# EasyEDA Pro project ProProject_Project_RK818_TestBoard.epro

# Board PCB1
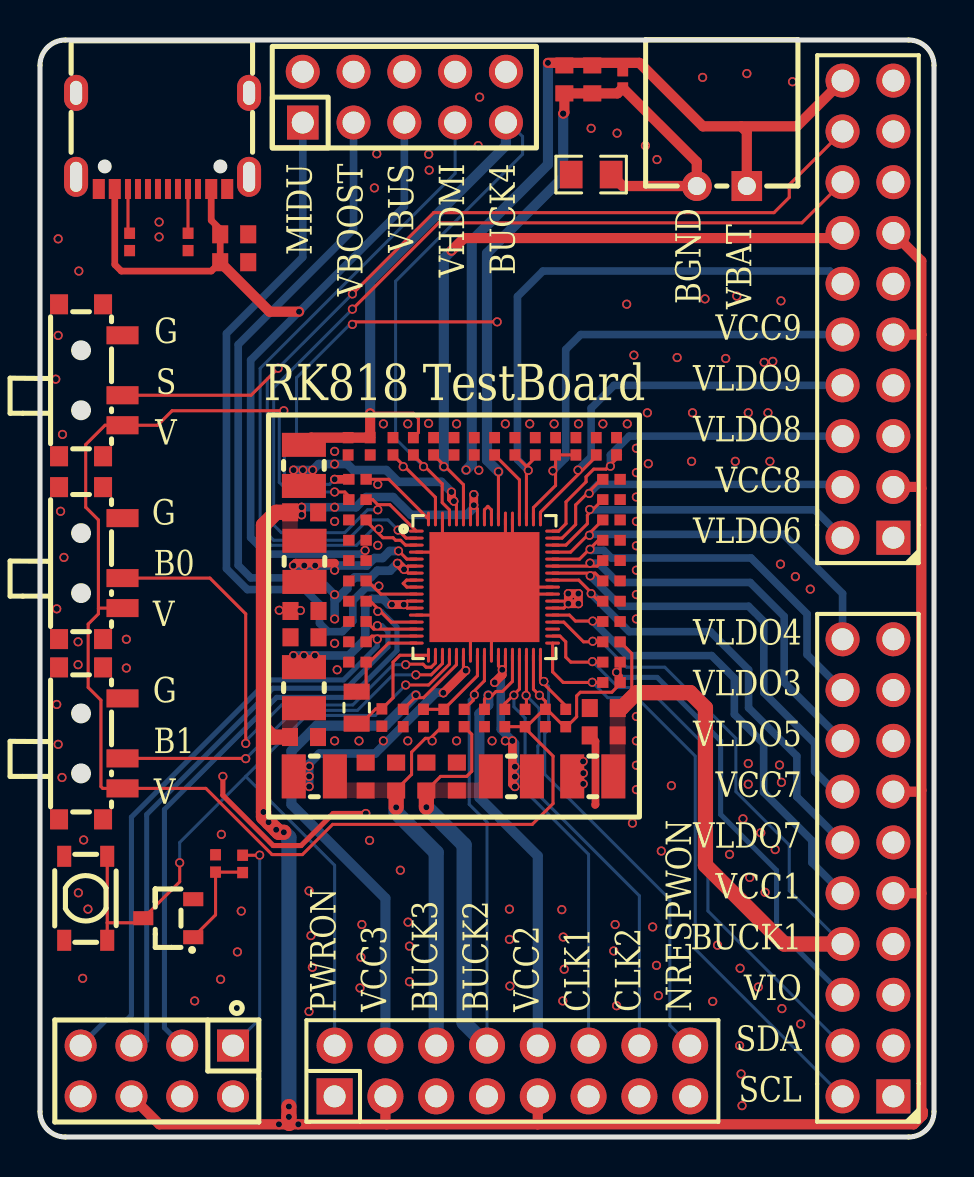
[diagram p0: board, top side]
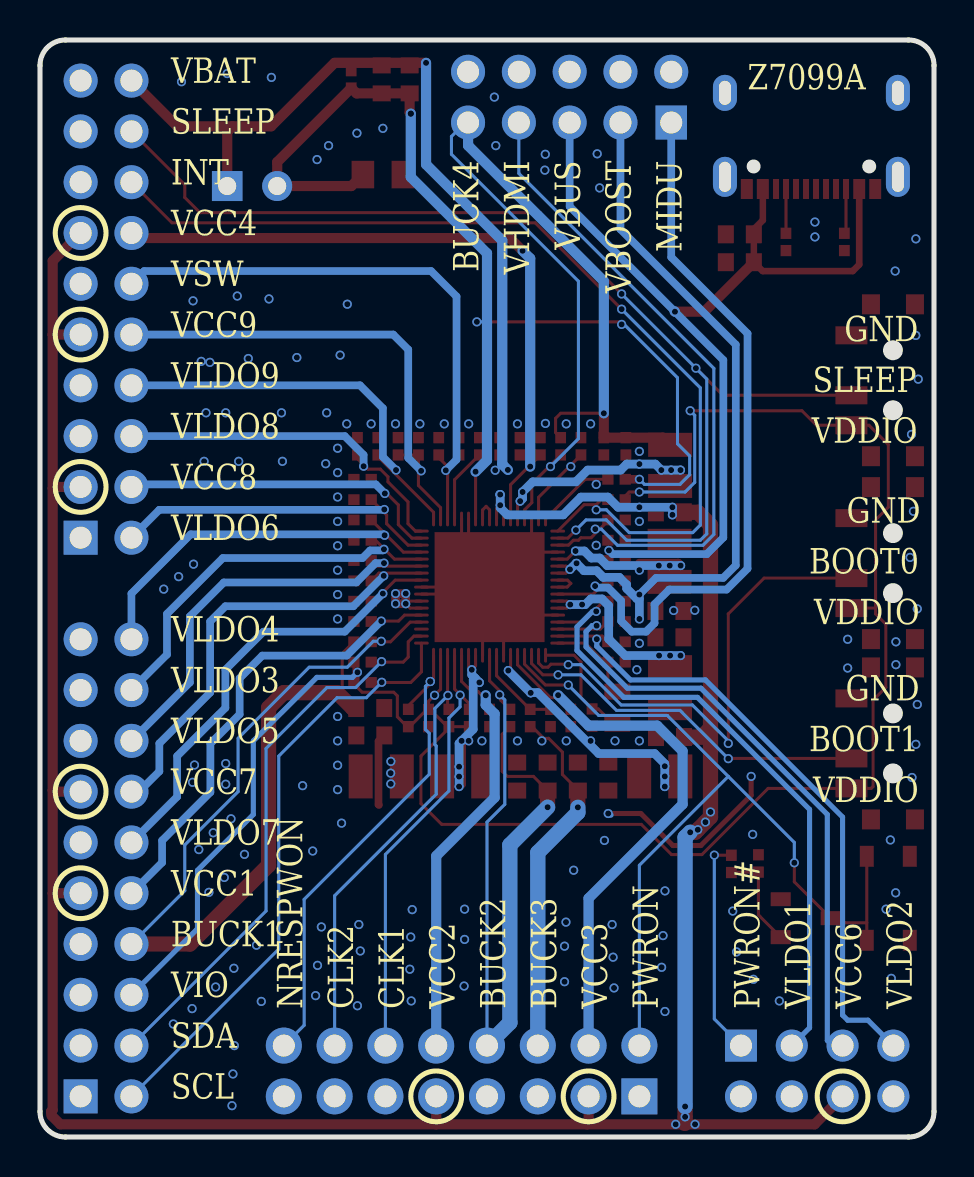
[diagram p1: board, bottom side, seen from below]

Outline 44.7 x 54.86 mm; copper layers: Top Layer, Bottom Layer. Coordinates in mm from the lower left corner of the outline.
Outline path: 0,53.59 0,1.27 arc(0.37,0.37) 1.27,0 43.43,0 arc(44.33,0.37) 44.7,1.27 44.7,53.59 arc(44.33,54.49) 43.43,54.86 1.27,54.86 arc(0.37,54.49) 0,53.59
Stack: Top Layer 0.035mm / Dielectric1 1.51mm FR4 er 4.5 / Bottom Layer 0.035mm

## Design rules (mm)
template: 用户自定义配置
spacing copperThickness1oz (default): track to track 0.102, other pairs 0.102 to 0.3
spacing copperThicknessInner0.5oz: track to track 0.089, other pairs 0.076 to 0.3
track width copperThickness1oz: min 0.076, default 0.152, max 2.54
track width copperThickness0.5oz: min 0.076, default 0.254, max 2.54
track width 50ohm-E (default): min 0.076, default 0.117, max 2.54
track width 50ohm-I: min 0.076, default 0.119, max 2.54
track width 40ohm-E: min 0.076, default 0.178, max 2.54
track width 40ohm-I: min 0.076, default 0.188, max 2.54
differential pair 90ohm-E: width min 0.076, default 0.102, max 2.54; gap min 0.102, default 0.102
differential pair 90ohm-I: width min 0.076, default 0.094, max 2.54; gap min 0.102, default 0.109
differential pair 100ohm-E (default): width min 0.076, default 0.094, max 2.54; gap min 0.152, default 0.16
differential pair 100ohm-I: width min 0.076, default 0.089, max 2.54; gap min 0.152, default 0.165
differential pair 80ohm-E: width min 0.076, default 0.137, max 2.54; gap min 0.102, default 0.117
differential pair 80ohm-I: width min 0.076, default 0.132, max 2.54; gap min 0.102, default 0.122
via viaSize (default): diameter min 0.457, default 0.457, max 10; hole min 0.279, default 0.3, max 6.299
net GND uses 内部电源
net $1N2385 uses 内部电源
net VSYS uses 内部电源
net $1N2423 uses 内部电源
net VBOOST uses 内部电源
net $1N3387 uses 内部电源
net $1N3668 uses 内部电源
net $1N3814 uses 内部电源
net $1N3998 uses 内部电源
pour e396 uses 内部电源
pour e426 uses 内部电源

## Placement (name value [footprint] x y rotation side)
C1  12.5pF  [C0402-无丝印-全尺寸]  15.88 23.75 180 top
C2  12.5pF  [C0402-无丝印-全尺寸]  17.09 20.98 270 top
C3  100nF  [C0402-无丝印-全尺寸]  22.73 34.54 90 top
C4  10uF  [C0402-无丝印-全尺寸]  25.27 20.95 90 top
C5  10uF  [C0402-无丝印-全尺寸]  15.88 29.84 0 top
C6  10uF  [C0402-无丝印-全尺寸]  15.88 28.83 0 top
C7  10uF  [C0402-无丝印-全尺寸]  15.88 30.86 0 top
C8  10uF  [C0402-无丝印-全尺寸]  15.88 27.81 0 top
C9  10uF  [C0402-无丝印-全尺寸]  21.72 34.54 270 top
C10  10uF  [C0402-无丝印-全尺寸]  20.7 34.54 270 top
C11  22uF  [C0603-无丝印-全尺寸]  13.21 31.24 180 top
C12  22uF  [C0603-无丝印-全尺寸]  13.2 20 180 top
C13  22uF  [C0603-无丝印-全尺寸]  13.23 24.99 0 top
C14  22uF  [C0603-无丝印-全尺寸]  13.23 26.31 0 top
C15  10uF  [C0402-无丝印-全尺寸]  28.58 25.78 180 top
C16  10uF  [C0402-无丝印-全尺寸]  22.22 20.95 90 top
C17  10uF  [C0402-无丝印-全尺寸]  18.16 20.95 90 top
C18  10uF  [C0402-无丝印-全尺寸]  19.69 34.54 270 top
C19  10uF  [C0402-无丝印-全尺寸]  15.88 25.78 0 top
C20  10uF  [C0402-无丝印-全尺寸]  28.58 27.81 180 top
C21  10uF  [C0402-无丝印-全尺寸]  28.58 32.89 180 top
C22  10uF  [C0402-无丝印-全尺寸]  26.8 34.54 270 top
C23  22uF  [C0603-无丝印-全尺寸]  28.19 21.45 0 top
C24  22uF  [C0603-无丝印-全尺寸]  28.19 20.08 0 top
C25  22uF  [C0603-无丝印-全尺寸]  19.32 18.03 270 top
C26  22uF  [C0603-无丝印-全尺寸]  20.84 18.03 270 top
C27  22uF  [C0603-无丝印-全尺寸]  16.28 18.03 270 top
C28  22uF  [C0603-无丝印-全尺寸]  17.81 18.03 270 top
C31  10uF  [C0402-无丝印-全尺寸]  15.88 26.8 0 top
C32  10uF  [C0402-无丝印-全尺寸]  15.88 24.76 0 top
C33  10uF  [C0402-无丝印-全尺寸]  28.58 29.84 180 top
C34  10uF  [C0402-无丝印-全尺寸]  28.58 28.83 180 top
C35  10uF  [C0402-无丝印-全尺寸]  28.58 26.8 180 top
C36  10uF  [C0402-无丝印-全尺寸]  28.58 30.86 180 top
C37  10uF  [C0402-无丝印-全尺寸]  28.58 31.88 180 top
C38  10uF  [C0402-无丝印-全尺寸]  28.83 34.54 270 top
C39  10uF  [C0402-无丝印-全尺寸]  27.81 34.54 270 top
C40  10uF  [C0402-无丝印-全尺寸]  23.75 34.54 270 top
C41  100nF  [C0402-无丝印-全尺寸]  29.14 52.89 270 top
C42  22uF  [C0603-无丝印-全尺寸]  27.62 52.89 90 top
C43  22uF  [C0603-无丝印-全尺寸]  26.22 52.89 90 top
C44  22uF  [C0603-无丝印-全尺寸]  9.71 43.75 180 top
C45  22uF  [C0603-无丝印-全尺寸]  9.71 45.15 180 top
C46  10uF  [C0402-无丝印-全尺寸]  15.41 34.54 90 top
C47  10uF  [C0402-无丝印-全尺寸]  16.51 34.54 90 top
C48  10uF  [C0402-无丝印-全尺寸]  24.77 34.54 270 top
C49  10uF  [C0402-无丝印-全尺寸]  25.78 34.54 270 top
CN1  ZX-XH2.54-2PWZ  [CONN-TH_2P-P2.50_ZX-XH2.54-2PWZ]  34.09 47.56 180 top
H1  -  [HDR-TH_10P-P2.54-V-F-R2-C5-S2.54]  18.22 52 0 top
H2  -  [HDR-TH_16P-P2.54-V-F-R2-C8-S2.54-1]  23.62 3.3 0 top
H3  -  [HDR-TH_20P-P2.54-V-R2-C10-S2.54]  41.4 41.4 90 top
H4  -  [HDR-TH_8P-P2.54-V-F-R2-C4-S2.54-1]  5.84 3.3 180 top
H5  -  [HDR-TH_20P-P2.54-V-R2-C10-S2.54]  41.4 13.46 90 top
R1  100K  [R0402-无丝印-全尺寸]  15.88 31.88 180 top
R2  100K  [R0402-无丝印-全尺寸]  23.24 20.95 270 top
R3  100K  [R0402-无丝印-全尺寸]  24.26 20.95 270 top
R4  4.7K  [R0402-无丝印-全尺寸]  28.58 22.73 0 top
R5  100K  [R0402-无丝印-全尺寸]  26.29 20.95 270 top
R6  4.7K  [R0402-无丝印-全尺寸]  28.58 23.75 0 top
R7  4.7K  [R0402-无丝印-全尺寸]  8.78 13.68 90 top
R8  22R  [R0402-无丝印-全尺寸]  10.13 13.66 270 top
R9  NC  [R0402-无丝印-全尺寸]  17.65 34.54 270 top
R10  10mΩ  [R0805]  27.56 48.13 0 top
R11  NC  [R0402-无丝印-全尺寸]  15.88 32.89 0 top
R12  100R  [R0402-无丝印-全尺寸]  28.58 24.76 0 top
R13  100R  [R0402-无丝印-全尺寸]  21.21 20.95 90 top
R14  47K  [R0402-无丝印-全尺寸]  20.19 20.95 90 top
R15  120K  [R0402-无丝印-全尺寸]  19.18 20.95 90 top
R16  100R  [R0402-无丝印-全尺寸]  18.67 34.54 90 top
R17  5.1K  [R0402-无丝印-全尺寸]  4.48 44.76 270 top
R18  5.1K  [R0402-无丝印-全尺寸]  7.4 44.76 270 top
SW1  TA-3524A-A1-W  [CONN-TH_TA-3524A-A2]  2.54 37.85 90 top
SW2  TA-3524A-A1-W  [CONN-TH_TA-3524A-A2]  2.54 28.7 90 top
SW3  TA-3524A-A1-W  [CONN-TH_TA-3524A-A2]  2.54 19.68 90 top
SW4  SKRPACE010  [KEY-SMD_4P-L4.2-W3.2-P2.20-LS4.6]  2.29 11.94 270 top
U1  RK818  [QFN-68_L7.0-W7.0-P0.35-BL-EP5.5]  22.22 27.5 0 top
U3  ao3400a  [SOT-23-3_L2.9-W1.3-P1.90-LS2.6-BR]  6.41 10.94 0 top
U4  470nH  [IND-SMD_L2.5-W2.0]  13.22 28.79 270 top
U5  470nH  [IND-SMD_L2.5-W2.0]  13.2 22.47 90 top
U6  470nH  [IND-SMD_L2.5-W2.0]  27.64 18.03 180 top
U7  470nH  [IND-SMD_L2.5-W2.0]  23.57 18.03 0 top
U8  470nH  [IND-SMD_L2.5-W2.0]  13.72 18.03 180 top
U9  470nH  [IND-SMD_L2.5-W2.0]  13.2 33.59 270 top
USB301  -  [usb_typec_2.0]  6.15 51.03 270 top
X1  32.768kHz  [CRYSTAL-SMD_2P-L2.0-W1.2]  15.83 21.47 90 top

## Footprints (pads in the part's own frame, mm; a bottom-side part is the same pattern mirrored in y, then rotated)
C0402-无丝印-全尺寸
  rect 0.566x0.54 smd: 1(-0.433,0) 2(0.433,0)
C0603-无丝印-全尺寸
  rect 0.8x0.9 smd: 1(-0.7,0) 2(0.7,0)
CONN-TH_2P-P2.50_ZX-XH2.54-2PWZ
  rect 1.524x1.5 hole 0.9: 1(-1.25,0)
  round 1.5 hole 0.9: 2(1.25,0)
CONN-TH_TA-3524A-A2
  rect 0.9x1.6 smd: 1(-2.25,-1.587) 2(-0.75,-1.587) 3(2.25,-1.587)
  rect 1x0.9 smd: 4(-3.8,-0.613) 5(-3.8,1.587) 6(3.8,-0.613) 7(3.8,1.587)
CRYSTAL-SMD_2P-L2.0-W1.2
  rect 0.8x1.3 smd: 1(-0.8,0) 2(0.8,0)
HDR-TH_8P-P2.54-V-F-R2-C4-S2.54-1
  rect 1.6x1.6 hole 1.1: 1(-3.81,-1.27)
  round 1.6 hole 1.1: 2(-3.81,1.27) 3(-1.27,-1.27) 4(-1.27,1.27) 5(1.27,-1.27) 6(1.27,1.27) 7(3.81,-1.27) 8(3.81,1.27)
HDR-TH_10P-P2.54-V-F-R2-C5-S2.54
  rect 1.575x1.7 hole 1.1: 1(-5.08,-1.27)
  round 1.7 hole 1.1: 2(-5.08,1.27) 3(-2.54,-1.27) 4(-2.54,1.27) 5(0,-1.27) 6(0,1.27) 7(2.54,-1.27) 8(2.54,1.27) 9(5.08,-1.27) 10(5.08,1.27)
HDR-TH_16P-P2.54-V-F-R2-C8-S2.54-1
  rect 1.8x1.8 hole 1.1: 1(-8.89,-1.27)
  round 1.8 hole 1.1: 2(-8.89,1.27) 3(-6.35,-1.27) 4(-6.35,1.27) 5(-3.81,-1.27) 6(-3.81,1.27) 7(-1.27,-1.27) 8(-1.27,1.27) 9(1.27,-1.27) 10(1.27,1.27) 11(3.81,-1.27) 12(3.81,1.27) 13(6.35,-1.27) 14(6.35,1.27) 15(8.89,-1.27) 16(8.89,1.27)
HDR-TH_20P-P2.54-V-R2-C10-S2.54
  rect 1.7x1.7 hole 1.1: 1(-11.43,-1.27)
  round 1.7 hole 1.1: 2(-11.43,1.27) 3(-8.89,-1.27) 4(-8.89,1.27) 5(-6.35,-1.27) 6(-6.35,1.27) 7(-3.81,-1.27) 8(-3.81,1.27) 9(-1.27,-1.27) 10(-1.27,1.27) 11(1.27,-1.27) 12(1.27,1.27) 13(3.81,-1.27) 14(3.81,1.27) 15(6.35,-1.27) 16(6.35,1.27) 17(8.89,-1.27) 18(8.89,1.27) 19(11.43,-1.27) 20(11.43,1.27)
IND-SMD_L2.5-W2.0
  rect 1.2x2.2 smd: 1(1.028,0) 2(-1.028,0)
KEY-SMD_4P-L4.2-W3.2-P2.20-LS4.6
  rect 1.05x0.7 smd: 1(-2.1,1.075) 2(2.1,1.075) 3(-2.1,-1.075) 4(2.1,-1.075)
QFN-68_L7.0-W7.0-P0.35-BL-EP5.5
  oval 0.74x0.15 smd: 1(-3.408,2.8) 2(-3.408,2.45) 3(-3.408,2.1) 4(-3.408,1.75) 5(-3.408,1.4) 6(-3.408,1.05) 7(-3.408,0.7) 8(-3.408,0.35) 9(-3.408,0) 10(-3.408,-0.35) 11(-3.408,-0.7) 12(-3.408,-1.05) 13(-3.408,-1.4) 14(-3.408,-1.75) 15(-3.408,-2.1) 16(-3.408,-2.45) 17(-3.408,-2.8) 35(3.408,-2.8) 36(3.408,-2.45) 37(3.408,-2.1) 38(3.408,-1.75) 39(3.408,-1.4) 40(3.408,-1.05) 41(3.408,-0.7) 42(3.408,-0.35) 43(3.408,0) 44(3.408,0.35) 45(3.408,0.7) 46(3.408,1.05) 47(3.408,1.4) 48(3.408,1.75) 49(3.408,2.1) 50(3.408,2.45) 51(3.408,2.8)
  oval 0.15x0.74 smd: 18(-2.8,-3.408) 19(-2.45,-3.408) 20(-2.1,-3.408) 21(-1.75,-3.408) 22(-1.4,-3.408) 23(-1.05,-3.408) 24(-0.7,-3.408) 25(-0.35,-3.408) 26(0,-3.408) 27(0.35,-3.408) 28(0.7,-3.408) 29(1.05,-3.408) 30(1.4,-3.408) 31(1.75,-3.408) 32(2.1,-3.408) 33(2.45,-3.408) 34(2.8,-3.408) 52(2.8,3.408) 53(2.45,3.408) 54(2.1,3.408) 55(1.75,3.408) 56(1.4,3.408) 57(1.05,3.408) 58(0.7,3.408) 59(0.35,3.408) 60(0,3.408) 61(-0.35,3.408) 62(-0.7,3.408) 63(-1.05,3.408) 64(-1.4,3.408) 65(-1.75,3.408) 66(-2.1,3.408) 67(-2.45,3.408) 68(-2.8,3.408)
  rect 5.5x5.5 smd: 69(0,0)
R0402-无丝印-全尺寸
  rect 0.566x0.54 smd: 1(-0.433,0) 2(0.433,0)
R0805
  rect 1.133x1.377 smd: 1(-1,0) 2(1,0)
SOT-23-3_L2.9-W1.3-P1.90-LS2.6-BR
  rect 1x0.7 smd: 1(1.25,-0.95) 2(1.25,0.95) 3(-1.25,0)
usb_typec_2.0
  rect 1x0.6 smd: A1B12(3.614,3.206) A4B9(3.614,2.406) B1A12(3.614,-3.213) B4A9(3.614,-2.414)
  rect 1x0.3 smd: A5(3.614,1.246) A6(3.614,0.246) A7(3.612,-0.254) A8(3.614,-1.254) B5(3.614,-1.754) B6(3.614,-0.754) B7(3.612,0.746) B8(3.614,1.746)
  oval 1.8x1.2 hole 1.2x0.6: EP(-1.194,4.3) EP(-1.194,-4.35)
  oval 2x1.2 hole 1.5x0.6: EP(3.006,4.3) EP(3.006,-4.35)

## Nets
GND: C1.2 C2.2 C3.2 C4.1 C5.1 C6.1 C7.1 C8.1 C9.1 C10.1 C11.1 C12.1 C13.1 C14.1 C15.1 C16.1 C17.1 C18.1 C19.1 C20.1 C21.1 C22.1 C23.1 C24.1 C25.1 C26.1 C27.1 C28.1 C31.1 C32.1 C33.1 C34.1 C35.1 C36.1 C37.1 C38.1 C39.1 C40.1 C44.1 C45.1 C46.1 C47.1 C48.1 C49.1 H1.2 H1.4 H1.6 H1.8 H1.10 H2.1 H2.5 H2.7 H2.11 H2.13 H2.15 H3.1 H3.5 H3.7 H3.11 H3.15 H3.17 H3.19 H4.2 H4.4 H4.8 H5.1 H5.3 H5.5 H5.7 H5.11 H5.15 H5.17 H5.19 R7.2 R9.1 R10.1 R15.1 R17.2 R18.2 SW1.3 SW1.4 SW1.5 SW1.6 SW1.7 SW2.3 SW2.4 SW2.5 SW2.6 SW2.7 SW3.3 SW3.4 SW3.5 SW3.6 SW3.7 SW4.3 SW4.4 U1.4 U1.13 U1.24 U1.27 U1.42 U1.43 U1.56 U1.57 U1.66 U1.69 U3.2 USB301.A1B12 USB301.B1A12 USB301.EP
VBAT: C9.2 C10.2 C41.1 C42.2 C43.2 CN1.1 H3.20 U1.59 U1.60
VBUS: C5.2 C6.2 C44.2 C45.2 H1.5 U1.8 U1.9 USB301.A4B9 USB301.B4A9
VCC1: C15.2 H5.10 U1.39
VCC2: C16.2 H2.10 U1.30
VCC3: C17.2 H2.4 U1.22
VCC4: C18.2 H3.14 U1.63
VCC6: C19.2 H4.5 U1.15
VCC7: C20.2 H5.14 U1.45
VCC8: C21.2 H3.4 U1.50
VCC9: C22.2 C49.2 H3.10 U1.53
VDDIO: C4.2 H5.6 R1.2 R2.2 R3.2 R4.2 R5.2 R6.2 SW1.1 SW2.1 SW3.1 U1.33
BATGND: C41.2 C42.1 C43.1 CN1.2 R10.2 R11.1 U1.58
BOOT0: SW2.2 U1.19
BOOT1: SW3.2 U1.20
BUCK1: C23.2 C24.2 H5.8 R12.1 R12.2 U1.38 U6.2
BUCK2: C25.2 C26.2 H2.8 R13.1 R13.2 U1.26 U7.2
BUCK3: C27.2 C28.2 H2.6 R14.1 U8.2
BUCK4: C46.2 C47.2 H1.9 R16.1 R16.2 U1.65 U9.2
CLK1: H2.12 R2.1 U1.31
CLK2: H2.14 R3.1 U1.32
INT: H3.16 R1.1 U1.1
MIDU: C8.2 H1.1 U1.10
NRESPWON: H2.16 R5.1 U1.34
PWRON: H2.2 SW4.1 SW4.2 U1.21 U3.3
PWRON#: H4.1 R8.1
SCL: H5.2 R4.1 U1.35
SDA: H5.4 R6.1 U1.36
SLEEP: H3.18 SW1.2 U1.2
VBOOST: C13.2 C14.2 H1.3 U1.6 U1.7
VHDMI: C7.2 H1.7 U1.3
VLDO1: C31.2 H4.3 U1.14
VLDO2: C32.2 H4.7 U1.16
VLDO3: C33.2 H5.18 U1.47
VLDO4: C36.2 H5.20 U1.48
VLDO5: C34.2 H5.16 U1.46
VLDO6: C37.2 H3.2 U1.49
VLDO7: C35.2 H5.12 U1.44
VLDO8: C38.2 H3.6 U1.51
VLDO9: C39.2 H3.8 U1.52
VSW: C40.2 C48.2 H3.12 U1.54
VSYS: C11.2 C12.2 H2.3 H2.9 H3.3 H3.9 H3.13 H4.6 H5.9 H5.13 U1.61 U1.62 U4.2 U5.2
$1N833: C1.1 U1.17 X1.2
$1N840: C2.1 U1.18 X1.1
$1N868: C3.1 U1.55
$1N1806: R7.1 R8.2 U3.1
$1N2209: R9.2 U1.67
$1N2385: U1.5 U4.1
$1N2423: U1.11 U1.12 U5.1
$1N2842: R11.2 U1.68
$1N3387: U1.40 U1.41 U6.1
$1N3668: U1.28 U1.29 U7.1
$1N3814: U1.23 U8.1
$1N3856: R14.2 R15.2 U1.25
$1N3998: U1.64 U9.1
$1N6386: R17.1 USB301.B5
$1N6390: R18.1 USB301.A5

Pads without a net: U1 37; USB301 A6 A7 A8 B6 B7 B8

## Via types
v1: diameter 0.457, hole 0.305, Top Layer to Bottom Layer, 258 vias

## Routing (per net, layer and track width the routed paths; a pad name or vN(x,y) marks a point on that pad's centre or on a via; arc(x,y) is an arc through that point)
GND: length 41.1
  Top Layer w0.152: U1.69 U1.43 ; U1.69 23.27,28.55 ; U1.69 20.47,29.25 ; U1.4 20.47,29.25 ; 20.47,29.25 20.12,29.6 U1.66 ; U1.27 22.57,27.15 U1.42 ; 23.27,28.55 U1.57 ; 23.27,28.55 23.62,28.9 U1.56 ; U1.24 21.52,26.8 20.82,26.1 U1.13
  Top Layer w0.254: v1(16.29,16.18) 14.66,16.18 13.06,14.58 11.66,14.58 9.14,17.09 v1(9.14,18.03)
  Top Layer w0.381: 27.76,16.61 27.78,16.63 27.78,19.79 C24.1
  Bottom Layer w0.254: 16.15,16.1 16.23,16.18 v1(16.29,16.18)
  vias: v1(0.79,37.9) v1(0.84,26.41) v1(0.84,21.63) v1(0.91,44.92) v1(0.91,40.09) v1(0.91,19.64) v1(1.03,31.29) v1(1.1,17.98) v1(1.12,35.14) v1(1.2,28.99) v1(1.94,43.31) v1(1.91,24.76) v1(1.91,23.62) v1(1.92,12.21) v1(2.18,14.86) v1(2.13,7.93) v1(2.4,11.4) v1(4.32,24.89) v1(4.32,23.45) v1(5.96,45.76) v1(5.96,45.01) v1(7.73,6.81) v1(9.07,15.13) v1(9.03,7.89) v1(9.87,9.26) v1(10.06,11.3) v1(11.96,26.34) v1(13.02,26.33) v1(13.45,12.31) v1(13.45,6.28) v1(13.55,10.07) v1(13.62,8.49) v1(14.73,34.29) v1(14.73,30.79) v1(14.73,24.69) v1(14.73,19.81) v1(14.86,23.37) v1(15.95,19.81) v1(16,7.45) v1(16.1,10.63) v1(16.05,8.99) v1(16.48,14.83) v1(16.72,47.47) v1(16.84,49.17) v1(17.17,35.67) v1(18.02,13.34) v1(18.39,35.67) v1(18.39,19.81) v1(18.4,10.75) v1(18.48,9.54) v1(18.48,7.77) v1(19.44,49.15) v1(19.46,48.35) v1(19.43,35.69) v1(20.83,35.67) v1(20.83,19.81) v1(21.98,52.01) v1(21.91,49.58) v1(22.61,19.81) v1(23.27,35.67) v1(23.47,11.4) v1(23.47,9.88) v1(23.5,7.55) v1(24.49,35.67) v1(25.71,35.67) v1(26.09,11.37) v1(26.16,10) v1(26.14,6.81) v1(26.21,8.39) v1(26.93,35.67) v1(27.56,50.45) v1(28.15,35.67) v1(28.69,9.3) v1(28.76,10.63) v1(28.86,50.2) v1(28.83,6.56) v1(29.34,41.65) v1(29.37,35.67) v1(29.7,39.1) v1(29.63,15.7) v1(29.82,34.45) v1(29.82,33.23) v1(29.82,32.01) v1(29.82,30.79) v1(29.82,29.57) v1(29.82,28.35) v1(29.82,27.13) v1(29.82,25.91) v1(29.82,21.03) v1(29.82,19.81) v1(29.82,18.59) v1(29.82,17.37) v1(30.27,49.58) v1(30.37,36.22) v1(30.42,33.67) v1(30.63,10.51) v1(30.85,48.88) v1(30.83,8.58) v1(30.92,7.07) v1(31.07,14.3) v1(31.57,17.57) v1(31.86,38.98) v1(32.58,33.79) v1(32.63,36.22) v1(33.13,52.99) v1(33.25,41.91) v1(33.64,6.78) v1(33.88,9.59) v1(34.29,38.93) v1(34.48,14.13) v1(34.77,33.79) v1(34.84,42.06) v1(34.98,4.57) v1(35.01,8.44) v1(35.06,3.15) v1(35.15,15.91) v1(35.1,1.57) v1(35.34,53.18) v1(35.42,36.22) v1(35.42,18.68) v1(35.42,17.64) v1(35.49,12.98) v1(35.92,7.5) v1(36.04,15.22) v1(36.21,38.74) v1(36.26,12.24) v1(36.4,36.22) v1(36.5,33.79) v1(36.64,38.79) v1(36.76,14.37) v1(36.98,18.6) v1(37.05,41.82) v1(37.03,28.65) v1(37.08,17.74) v1(37.1,6.42) v1(37.63,52.78) v1(37.77,28.02) v1(38.04,5.65) v1(38.52,27.4)
VBAT: length 43.6
  Top Layer w0.152: U1.59 22.57,31.36 22.4,31.54 22.22,31.37 U1.60
  Top Layer w0.508: 35.06,50.55 35.34,50.26 CN1.1 ; 35.06,50.55 37.85,50.55 H3.20 ; 35.06,50.55 33.15,50.55 29.97,53.72 v1(25.4,53.72)
  Bottom Layer w0.508: v1(25.4,53.72) 25.4,48.64 21.59,44.83 21.59,33.64 v1(21.31,33.36)
  vias: v1(21.94,33.35)
VBUS: length 49.7
  Top Layer w0.152: U1.8 18.33,27.85 18.16,27.69 18.35,27.5 U1.9
  Top Layer w0.33: USB301.A4B9 8.56,45.85 9.01,45.4 C44.2 8.57,43.31 4.06,43.31 3.74,43.63 USB301.B4A9
  Top Layer w0.508: C44.2 11.49,41.27 v1(12.95,41.27)
  Bottom Layer w0.381: v1(12.95,41.27) 10.53,38.85 10.53,29.98 11.36,29.15 16.07,29.15 v1(16.26,29.34) ; 12.97,41.29 18.22,46.54 H1.5
  Bottom Layer w0.508: v1(12.95,41.27) 12.97,41.29
  vias: v1(16.89,29.59)
VCC1: length 23.9
  Top Layer w0.152: C15.2 28.12,25.8 v1(27.64,25.8) 26.77,25.8 26.48,26.1 U1.39
  Bottom Layer w0.381: H5.10 38.6,13.73 38.6,14.83 36.18,17.24 36.18,19.68 34.72,21.14 34.72,22.94 33.59,24.08 29.37,24.08 v1(27.64,25.8)
VCC2: length 22.5
  Top Layer w0.152: C16.2 22.22,21.9 v1(22.42,22.09) 22.61,22.09 22.8,22.28 23.12,22.28 23.62,22.79 U1.30
  Bottom Layer w0.508: H2.10 24.89,14.06 21.97,16.98 21.97,21.16 22.42,21.61 v1(22.42,22.09)
VCC3: length 28.1
  Top Layer w0.152: U1.22 20.82,23.62 19.18,21.97 18.74,21.97 C17.2
  Bottom Layer w0.508: v1(18.8,22.1) 17.27,20.57 13.84,20.57 12.57,19.3 12.57,16.64 17.27,11.94 H2.4
VCC4: length 34.7
  Top Layer w0.152: U1.63 21.17,32.62 19.69,34.11
  Top Layer w0.508: v1(20.57,44.32) 21.21,44.96 39.88,44.96 H3.14
  Bottom Layer w0.508: v1(20.57,44.32) 20.19,43.94 v1(20.19,33.53)
VCC6: length 31.8
  Top Layer w0.152: U1.15 16.69,25.4 C19.2
  Bottom Layer w0.254: H4.5 5.08,4.57 5.33,4.83 5.33,16.13 11.65,22.45 15.33,22.45 17.4,24.51 17.4,25.27 17.1,25.57 v1(16.87,25.57)
VCC7: length 22.7
  Top Layer w0.152: C20.2 27.75,28.2 U1.45
  Bottom Layer w0.381: H5.14 39.75,17.27 38.74,18.29 38.74,19.68 36.19,22.22 36.19,25.78 35.43,26.54 29.04,26.54 v1(27.52,28.06)
VCC8: length 17.2
  Top Layer w0.152: U1.50 26.11,29.95 26.78,30.63 26.78,31.61 28.07,32.89 C21.2
  Bottom Layer w0.381: H3.4 40,32.64 27.91,32.64 v1(27.46,32.18)
VCC9: length 25.2
  Top Layer w0.152: U1.53 24.67,31.48 25.78,32.58 25.78,34.11 26.8,34.11
  Bottom Layer w0.381: H3.10 27.04,40.13 26.29,39.38 26.29,33.96 v1(25.65,33.32)
VDDIO: length 100.7
  Top Layer w0.152: 29.01,23.06 R6.2 ; C4.2 25.35,21.39 26.21,20.52 R5.2 ; C4.2 25.27,21.79 24.67,22.39 U1.33 ; C4.2 25.2,21.39 24.33,20.52 R3.2 ; v1(12.19,36.32) 6.6,36.32 5.88,35.6 SW1.1 3.25,35.6 2.29,34.63 2.29,31.5 2.92,30.86 2.92,26.45 ; R4.2 29.01,22.66 28.59,22.24 27.02,22.24 26.83,22.06 26.83,21.02 26.43,20.61 ; R2.2 R3.2 ; R3.2 24.26,20.45 25.65,19.05 25.65,16.67 24.62,15.64 14.63,15.64 13.12,14.12 11.6,14.12 8.29,17.43 SW3.1 3.14,17.43 3.05,17.53 3.05,21.84 2.41,22.48 2.41,25.65 2.92,26.16 2.92,26.45 ; v1(14.73,32.26) 15.24,32.26 15.44,32.06 R1.2 ; 2.92,26.45 SW2.1
  Top Layer w0.254: R4.2 29.01,23.06 v1(28.83,23.24)
  Bottom Layer w0.152: v1(12.19,36.32) 11.97,36.1 11.97,32.74 12.45,32.26 v1(14.73,32.26)
  Bottom Layer w0.254: H5.6 36.83,10.41 36.83,13.33 34.04,16.13 34.04,19.81 30.86,22.99 29.08,22.99 v1(28.83,23.24)
  vias: v1(24.97,22.09)
BATGND: length 57.4
  Top Layer w0.152: v1(15.62,40.64) 15.75,40.77 v1(22.86,40.77) ; v1(22.92,33.27) U1.58
  Top Layer w0.432: R11.1 v1(14.73,32.89)
  Top Layer w0.508: R10.2 29.13,47.56 CN1.2 32.84,48.76 29.14,52.46 28.87,52.19 C42.1 C43.1 26.22,51.24 v1(26.16,51.18)
  Bottom Layer w0.152: v1(14.73,32.89) 14.48,32.64 12.7,32.64 12.22,33.12 12.22,34.06 12.83,34.67 12.83,37.97 15.49,40.64 v1(15.62,40.64) ; v1(22.86,40.77) 22.35,40.77
  Bottom Layer w0.508: v1(26.16,51.18) 26.16,48.01 22.35,44.2 22.35,33.85 v1(22.92,33.27)
BOOT0: length 25.1
  Top Layer w0.152: U1.19 19.77,23.71 19.56,23.49 19.3,23.49 19.15,23.65 18.31,23.65 v1(18.29,23.62) ; SW2.2 8.5,27.95 10.29,26.16 v1(10.29,19.68)
  Bottom Layer w0.152: v1(18.29,23.62) 17.66,23.62 15.64,21.61 12.08,21.61 10.29,19.81 v1(10.29,19.68)
BOOT1: length 18.4
  Top Layer w0.152: SW3.2 10.28,18.93 v1(10.29,18.92) ; v1(18.8,23.11) 19.56,23.11 20.12,23.68 U1.20
  Bottom Layer w0.152: v1(18.8,23.11) 17.65,23.11 15.88,21.34 12.7,21.34 v1(10.29,18.92)
BUCK1: length 49.8
  Top Layer w0.152: R12.2 29.59,24.18 29.59,22.15 C23.2 ; R12.1 27.18,24.76 26.19,25.75 U1.38
  Top Layer w0.762: H5.8 37.21,9.65 33.27,13.59 33.27,21.46 32.51,22.22 29.84,22.22 29.07,21.45 C23.2
  Bottom Layer w0.152: H5.8 37.47,12.32 37.47,14.6 34.8,17.27 34.8,19.94 31.24,23.49 29.34,23.49 28.04,24.79 v1(27.64,24.79)
BUCK2: length 40.2
  Top Layer w0.152: R13.2 21.66,21.84 21.66,22.25 22.22,22.82 U1.26 ; C25.2 20.03,18.03 21.34,18.03 21.59,18.29 21.59,20.14 R13.1
  Top Layer w0.762: C25.2 v1(19.32,16.49)
  Bottom Layer w0.152: v1(21.72,22.12) 21.46,21.86 21.46,16.64 22.35,15.75 H2.8
  Bottom Layer w0.762: H2.8 21.21,5.71 21.21,14.6 v1(19.32,16.49)
BUCK3: length 17.9
  Top Layer w0.152: 20.19,20.45 20.03,20.45 19.51,19.94 19.27,19.94 18.58,19.25 18.58,18.13 17.78,17.34
  Top Layer w0.762: C28.2 v1(17.81,16.49)
  Bottom Layer w0.762: H2.6 19.81,14.22 17.81,16.23 v1(17.81,16.49)
  vias: v1(19.61,19.81)
BUCK4: length 50.4
  Top Layer w0.152: U1.65 20.47,31.36 20.11,31.73 20.11,32.67 18.67,34.11 ; R16.2 18.92,35.23 18.92,35.94 18.67,36.19 v1(16.51,36.19)
  Top Layer w0.508: v1(16.51,36.19) C47.2 C46.2 13.56,34.98 U9.2
  Bottom Layer w0.152: v1(19.18,33.53) 17.78,34.92 17.78,42.8 24.13,49.15 24.13,50.04 23.43,50.73 H1.9
  Bottom Layer w0.508: v1(16.51,36.19) 16.51,42.8 23.3,49.59 H1.9
CLK1: length 22.1
  Top Layer w0.152: R2.1 23.24,21.67 23.97,22.4 U1.31
  Bottom Layer w0.152: H2.12 27.43,14.13 24.26,17.31 24.26,20.95 23.7,21.51 v1(23.7,22.1)
CLK2: length 22.6
  Top Layer w0.152: U1.32 24.32,21.46 R3.1
  Bottom Layer w0.152: H2.14 29.97,12.06 24.89,17.14 24.89,19.56 24.96,19.62 24.96,21.43 v1(24.31,22.08)
INT: length 48.6
  Top Layer w0.152: H3.16 38.1,45.72 19.94,45.72 v1(15.62,41.4) ; R1.1 16.64,31.88 16.89,31.62 17.49,31.62 U1.1
  Bottom Layer w0.152: v1(16.89,31.37) 16.38,31.37 15.24,30.23 12.06,30.23 11.68,30.61 11.68,37.46 v1(15.62,41.4)
MIDU: length 37.7
  Top Layer w0.152: U1.10 17.04,27.15 16.38,27.81 C8.2
  Bottom Layer w0.381: v1(16.95,27.55) 16.87,27.47 16.3,27.47 15.64,26.82 15.64,25.8 15.11,25.27 14.4,25.27 13.97,25.7 13.97,26.65 13.24,27.38 10.37,27.38 9.32,28.43 9.32,40.19 13.14,44 13.14,50.73
NRESPWON: length 24.6
  Top Layer w0.152: U1.34 25.02,22.83 26.29,21.56 R5.1
  Bottom Layer w0.152: H2.16 31.5,5.59 31.5,11.88 25.24,18.14 25.24,20.19 25.43,20.38 25.43,22.54 v1(25.19,22.78)
PWRON: length 43.6
  Top Layer w0.152: 3.36,10.71 4.93,10.71 U3.3 6.99,12.76 v1(6.99,13.72) ; 3.36,10.71 SW4.1 ; 3.36,10.71 SW4.2 ; U1.21 20.47,23.65 19.43,22.61 v1(18.29,22.61)
  Bottom Layer w0.152: v1(6.99,13.72) 6.99,14.73 10.29,18.03 ; 10.29,18.03 14.73,13.59 H2.2 ; 10.29,18.03 13.34,21.08 16.76,21.08 v1(18.29,22.61)
PWRON#: length 10.9
  Top Layer w0.152: v1(10.98,14.1) 10.98,14.09 R8.1
  Bottom Layer w0.152: H4.1 10.98,5.9 v1(10.98,14.1)
SCL: length 30.9
  Top Layer w0.152: R4.1 26.16,22.73 25.63,23.26 U1.35
  Bottom Layer w0.152: H5.2 32.77,9.4 32.77,19.05 29.84,21.97 28.39,21.97 v1(27.62,22.74)
SDA: length 28.7
  Top Layer w0.152: U1.36 26,25.05 26.29,24.76 26.29,24 26.54,23.75 R6.1
  Bottom Layer w0.152: v1(27.62,23.78) 28.92,22.48 30.35,22.48 33.4,19.43 33.4,11.3 H5.4
SLEEP: length 58.7
  Top Layer w0.152: H3.18 37.47,47.62 37.47,46.99 36.7,46.23 19.69,46.23 v1(15.62,42.16) ; v1(17.91,30.35) 18.31,29.95 U1.2 ; v1(11.91,38.45) 10.55,37.1 SW1.2
  Bottom Layer w0.152: v1(17.91,30.35) 17.4,30.86 16.38,30.86 15.37,29.84 11.68,29.84 11.36,30.17 11.36,37.91 v1(11.91,38.45) v1(15.62,42.16)
VBOOST: length 37.1
  Top Layer w0.152: U1.6 18.4,28.55 18.23,28.38 18.41,28.2 U1.7
  Top Layer w0.432: v1(17.87,28.69) 17.9,28.69 v1(18.2,28.39)
  Bottom Layer w0.381: v1(14.73,27.13) 13.9,27.96 10.54,27.96 9.91,28.59 9.91,39.63 15.68,45.4 H1.3
  Bottom Layer w0.432: 14.73,26.03 14.73,26.92 14.86,26.92 15.37,27.43 15.37,27.62 15.74,27.99 16.54,27.99 16.87,28.32 17.5,28.32 v1(17.87,28.69) 17.9,28.69 v1(18.2,28.39)
  vias: v1(14.73,25.91)
VHDMI: length 34.2
  Top Layer w0.152: U1.3 18.28,29.6 18.03,29.84 17.78,29.84 17.65,29.97 17.15,29.97 16.31,30.81 C7.2
  Bottom Layer w0.152: 20.76,50.73 20.76,48.19 11.01,38.44 11.01,30.14 11.56,29.59 15.82,29.59 16.63,30.4 v1(16.94,30.4)
VLDO1: length 32.5
  Top Layer w0.152: U1.14 17.56,25.75 16.52,26.8 C31.2
  Bottom Layer w0.254: v1(16.89,26.29) 17.07,26.29 17.85,25.51 17.85,24.33 15.51,21.99 11.83,21.99 6.22,16.38 6.22,5.46 H4.3
VLDO2: length 31.9
  Top Layer w0.152: U1.16 16.59,25.05 C32.2
  Bottom Layer w0.254: H4.7 3.3,5.84 4.32,5.84 4.57,6.1 4.57,16 11.43,22.86 15.18,22.86 16.86,24.54 v1(16.86,24.9)
VLDO3: length 19.6
  Top Layer w0.152: U1.47 26.98,28.9 27.92,29.84 C33.2
  Bottom Layer w0.381: H5.18 38.35,24.13 38.35,26.16 35.56,28.96 28.58,28.96 28.19,29.34 27.56,29.34 v1(27.5,29.39)
VLDO4: length 19.4
  Top Layer w0.152: U1.48 26.53,29.25 C36.2
  Bottom Layer w0.381: H5.20 40.13,27.18 37.17,30.14 27.52,30.14 v1(27.47,30.09)
VLDO5: length 20.9
  Top Layer w0.152: C34.2 27.86,28.55 U1.46
  Bottom Layer w0.381: H5.16 37.21,22.73 37.21,26.03 35.51,27.73 28.89,27.73 27.92,28.7 v1(27.5,28.7)
VLDO6: length 16.9
  Top Layer w0.152: U1.49 26.3,29.6 27.37,30.67 27.37,31.1 C37.2
  Bottom Layer w0.381: v1(27.49,31.38) 27.5,31.37 38.74,31.37 H3.2
VLDO7: length 23
  Top Layer w0.152: U1.44 26.94,27.85 27.56,27.23 v1(27.56,27.18) 27.94,26.8 C35.2
  Bottom Layer w0.381: H5.12 37.85,17.02 37.85,19.05 35.43,21.46 35.43,23.37 33.53,25.27 29.46,25.27 v1(27.56,27.18)
VLDO8: length 18.3
  Top Layer w0.152: U1.51 25.93,30.3 26.3,30.67 26.3,31.76 27.31,32.77 27.31,33.02 27.69,33.4 28.31,33.4 29.03,34.13
  Bottom Layer w0.381: H3.6 29.46,35.05 28.52,34.11 v1(28.52,33.55)
VLDO9: length 20.9
  Top Layer w0.152: U1.52 25.02,31.25 27.98,34.21
  Bottom Layer w0.381: v1(26.9,33.35) 27.56,34.01 27.56,36.45 28.7,37.59 H3.8
VSW: length 30.2
  Top Layer w0.152: U1.54 24.32,33.54 ; 24.32,33.54 24.77,33.98 24.77,34.11 ; 24.32,33.54 23.75,34.11
  Bottom Layer w0.381: v1(24.41,33.34) 23.88,33.88 23.88,42.04 25.15,43.31 39.5,43.31 H3.12
VSYS: length 140.1
  Top Layer w0.152: U1.62 21.52,31.43 v1(21.69,31.6) 21.87,31.41 U1.61
  Top Layer w0.432: v1(21.69,31.6) v1(21.69,32.13) ; v1(13.08,31.11) v1(13.08,31.5)
  Top Layer w0.508: H2.3 17.27,0.7 17.34,0.63 ; 24.89,0.63 17.34,0.63 ; 24.89,0.63 H2.9 ; 24.89,0.63 43.69,0.63 44.12,1.07 arc(44.14,1.17) 44.15,1.27 44.07,1.35 44.07,12.19 ; 17.34,0.63 v1(12.92,0.63) 12.51,0.63 ; H4.6 5.97,0.63 v1(11.95,0.63) 12.47,0.63 ; 44.07,40.13 44.06,40.13 H3.9 ; 44.07,40.13 44.07,43.81 H3.13 ; 44.07,40.13 44.07,32.45 ; H5.13 43.99,17.27 44.07,17.35 ; 44.07,12.19 H5.9 ; 44.07,12.19 44.07,17.35 ; 44.07,17.35 44.07,32.45 ; H3.3 44.01,32.51 44.07,32.45
  Top Layer w0.762: v1(12.19,15.24) 11.94,15.24 v1(11.81,15.37) v1(11.43,15.75) 11.18,16 v1(11.18,16.26) 11.18,20.45 ; 11.18,20.45 11.18,30.61 11.81,31.24 C11.2 ; 11.18,20.45 11.62,20 C12.2 ; 12.47,0.68 12.45,0.7 v1(12.45,1.01) v1(12.45,1.52)
  Bottom Layer w0.432: v1(21.69,32.13) 21.72,32.13 21.69,32.11 v1(21.69,31.6) 21.69,31.47 21.34,31.11 18.54,31.11 17.65,32 16.31,32 15.8,31.5 v1(14.73,31.5) v1(13.08,31.5) v1(13.08,31.11)
  Bottom Layer w0.762: v1(12.45,1.52) 12.45,14.99 v1(12.19,15.24)
$1N833: length 4.8
  Top Layer w0.152: U1.17 17.43,24.7 16.48,23.75 C1.1 16.31,22.4 16.18,22.27 X1.2
$1N840: length 6.1
  Top Layer w0.152: X1.1 16.05,20.67 16.79,21.41 C2.1 17.65,21.97 17.65,23.75 18,24.09 U1.18
$1N868: length 3.7
  Top Layer w0.152: 22.73,34.11 23.97,32.87 U1.55
$1N1806: length 5.1
  Top Layer w0.152: R8.2 10.11,13.25 R7.1 8.78,11.11 U3.1
$1N2209: length 4.1
  Top Layer w0.152: U1.67 19.77,31.99 17.65,34.11
  vias: v1(18.16,33.53)
$1N2385: length 8.7
  Top Layer w0.152: v1(17.93,29.31) 17.94,29.31 18.34,28.9 U1.5
  Top Layer w0.432: v1(12.67,28.58) 12.79,28.7 14.73,28.7
  Bottom Layer w0.432: v1(12.67,28.58) v1(13.22,28.58) v1(13.76,28.58) 16.34,28.58 16.72,28.96 17.13,28.96 17.48,29.31 v1(17.93,29.31)
  vias: v1(14.73,28.35)
$1N2423: length 9.8
  Top Layer w0.152: U1.12 18.37,26.45 v1(18.19,26.63) 18.36,26.8 U1.11 ; 18.14,26.59 18.14,26.59
  Top Layer w0.432: v1(18.19,26.63) 17.6,26.63 v1(17.6,26.63)
  Bottom Layer w0.432: v1(18.19,26.63) 17.44,26.63 17.16,26.91 16.6,26.91 16.27,26.57 16.27,24.9 15.44,24.08 v1(13.75,24.08) v1(13.2,24.08) v1(12.68,24.08)
$1N2842: length 3.9
  Top Layer w0.152: U1.68 17.44,32.89 R11.2
  vias: v1(16.89,32.64)
$1N3387: length 3.7
  Top Layer w0.152: U1.40 26.2,26.45 v1(26.42,26.67) 26.28,26.8 U1.41
  Top Layer w0.432: v1(26.92,26.67) v1(26.42,26.67) v1(26.42,27.18) v1(26.92,27.18) v1(26.92,26.67)
  vias: v1(27.16,18.78) v1(27.17,18.2) v1(27.16,17.66)
$1N3668: length 11.3
  Top Layer w0.152: U1.29 23.27,23.53 v1(23.11,23.37) 22.92,23.56 U1.28
  Top Layer w0.432: v1(22.73,22.73) 23.11,23.11 v1(23.11,23.37) ; v1(23.62,19.81) 23.62,17.65 v1(23.75,17.53)
  Bottom Layer w0.432: v1(22.73,22.73) 22.95,22.95 ; 22.95,22.95 23.11,23.11 v1(23.11,23.37) ; 22.95,22.95 23.04,22.86 23.04,20.39 v1(23.62,19.81) 23.75,19.68 v1(23.75,18.52) v1(23.75,18.03) v1(23.75,17.53)
  vias: v1(23.27,19.81)
$1N3814: length 13.3
  Top Layer w0.152: U1.23 21.17,23.44 v1(21.29,23.33)
  Top Layer w0.432: v1(21.29,23.33) 20.17,22.21 v1(20.17,22.21)
  Bottom Layer w0.432: v1(13.46,17.53) v1(13.46,18.03) 13.46,18.67 13.97,19.18 16.76,19.18 19.81,22.22 20.15,22.22 v1(20.17,22.21) 20.17,22.21 v1(21.29,23.33)
  vias: v1(13.46,18.54) v1(17.17,19.81)
$1N3856: length 4.4
  Top Layer w0.152: R15.2 R14.2 21.87,23.07 U1.25
$1N3998: length 10.6
  Top Layer w0.152: v1(20.7,31.8) 20.82,31.67 U1.64
  Top Layer w0.432: v1(20.7,31.8) 20.57,31.92 v1(20.57,32.26)
  Bottom Layer w0.432: v1(12.68,33.35) v1(13.15,33.35) v1(13.64,33.35) 13.94,33.65 v1(14.73,33.65) 15.37,33.65 15.67,33.35 17.32,33.35 17.91,32.77 20.07,32.77 v1(20.57,32.26) 20.57,31.92 v1(20.7,31.8)
$1N6386: length 2.2
  Top Layer w0.152: USB301.B5 4.4,45.28 R17.1
$1N6390: length 2.2
  Top Layer w0.152: R18.1 7.4,45.2 USB301.A5

## Copper pours and planes (outline as drawn; the poured copper is in the pictures)
GND on Top Layer: -12.19,62.48 50.93,62.48 50.93,-10.16 -12.19,-10.16
GND on Bottom Layer: -10.86,61.59 52.26,61.59 52.26,-11.05 -10.86,-11.05
VBAT on Top Layer: 20.47,34.09 20.47,33.83 22.15,32.15 22.15,31.38 22.64,31.38 22.65,31.39 22.65,33.34 21.6,34.39 20.76,34.39
VBUS on Top Layer: 16.05,30.09 16.05,29 16.8,28.24 16.8,27.77 17.15,27.43 18.3,27.43 18.3,27.91 17.38,28.83 17.38,29.18 16.52,30.04 16.47,30.04 16.43,30.09
BUCK1 on Top Layer: 28.49,21.67 29.27,21.67 29.27,17.88 28.49,17.88
BUCK2 on Top Layer: 19.01,17.73 22.8,17.73 22.8,16.95 19.01,16.95
BUCK3 on Top Layer: 14.36,17.73 18.14,17.73 18.14,16.95 14.36,16.95
VBOOST on Top Layer: 13.55,26.75 14.24,26.75 14.58,27.08 14.75,26.92 14.95,26.92 14.95,25.94 13.68,24.67 13.53,24.67 13.53,26.73
VSYS on Top Layer: 12.12,31.37 12.89,31.37 12.89,29.29 12.12,29.29
VSYS on Top Layer: 12.11,21.66 12.88,21.66 12.88,19.57 12.11,19.57
VSYS on Bottom Layer: 10.67,16.51 11.43,16.51 12.69,15.25 12.69,14.99 12.3,14.6 11.81,14.6 10.67,15.75
VSYS on Bottom Layer: 11.56,2.03 13.34,2.03 13.34,0.25 11.56,0.25
$1N2385 on Top Layer: 12.13,28.35 12.59,28.8 13.88,28.8 14.3,28.38 14.3,28.31 14.32,28.28 12.2,28.28
$1N2423 on Top Layer: 12.11,23.95 12.58,23.48 13.86,23.48 14.3,23.92 13.89,24.34 12.5,24.34
$1N3387 on Top Layer: 26.95,19.13 27.14,19.13 27.39,18.87 27.39,17.38 26.95,16.94 26.52,17.37 26.52,18.7
$1N3387 on Bottom Layer: 25.66,26.64 25.66,18.15 26.67,17.14 27.22,17.14 27.64,17.57 27.64,26.71 26.96,27.39 26.41,27.39
$1N3668 on Top Layer: 24.01,19.12 23.52,18.63 23.52,17.43 24.01,16.94 24.67,17.6 24.67,18.46
$1N3814 on Top Layer: 13.29,19.12 13.69,18.72 13.69,17.36 13.28,16.95 12.84,17.38 12.84,18.67
$1N3998 on Top Layer: 12.12,33.14 12.54,33.56 13.89,33.56 14.29,33.16 14,32.87 12.39,32.87

## Text on the board
Bottom Silkscreen Layer: MIDU | VBOOST | VBUS | VHDMI | BUCK4 | Z7099A | VBAT | SLEEP | INT | VCC4 | VSW | VCC9 | VLDO9 | VLDO8 | VCC8 | VLDO6 | VLDO4 | VLDO3 | VLDO5 | VCC7 | VLDO7 | VCC1 | BUCK1 | VIO | SDA | SCL | GND | VDDIO | BOOT0 | BOOT1 | VLDO2 | VCC6 | VLDO1 | PWRON# | PWRON | VCC3 | BUCK3 | BUCK2 | VCC2 | CLK1 | CLK2 | NRESPWON
Top Silkscreen Layer: PWRON | VCC3 | BUCK3 | BUCK2 | VCC2 | CLK1 | CLK2 | NRESPWON | G | V | B0 | B1 | S | VCC9 | VLDO9 | VLDO8 | VCC8 | VLDO6 | VLDO4 | VLDO3 | VLDO5 | VCC7 | VLDO7 | VCC1 | BUCK1 | VIO | SDA | SCL | BGND | VBAT | MIDU | VBOOST | VBUS | VHDMI | BUCK4 | RK818 TestBoard
